# Altium schematic sheet Schematic.SchDoc
size B; SheetNumber: 1; SheetTotal: 1
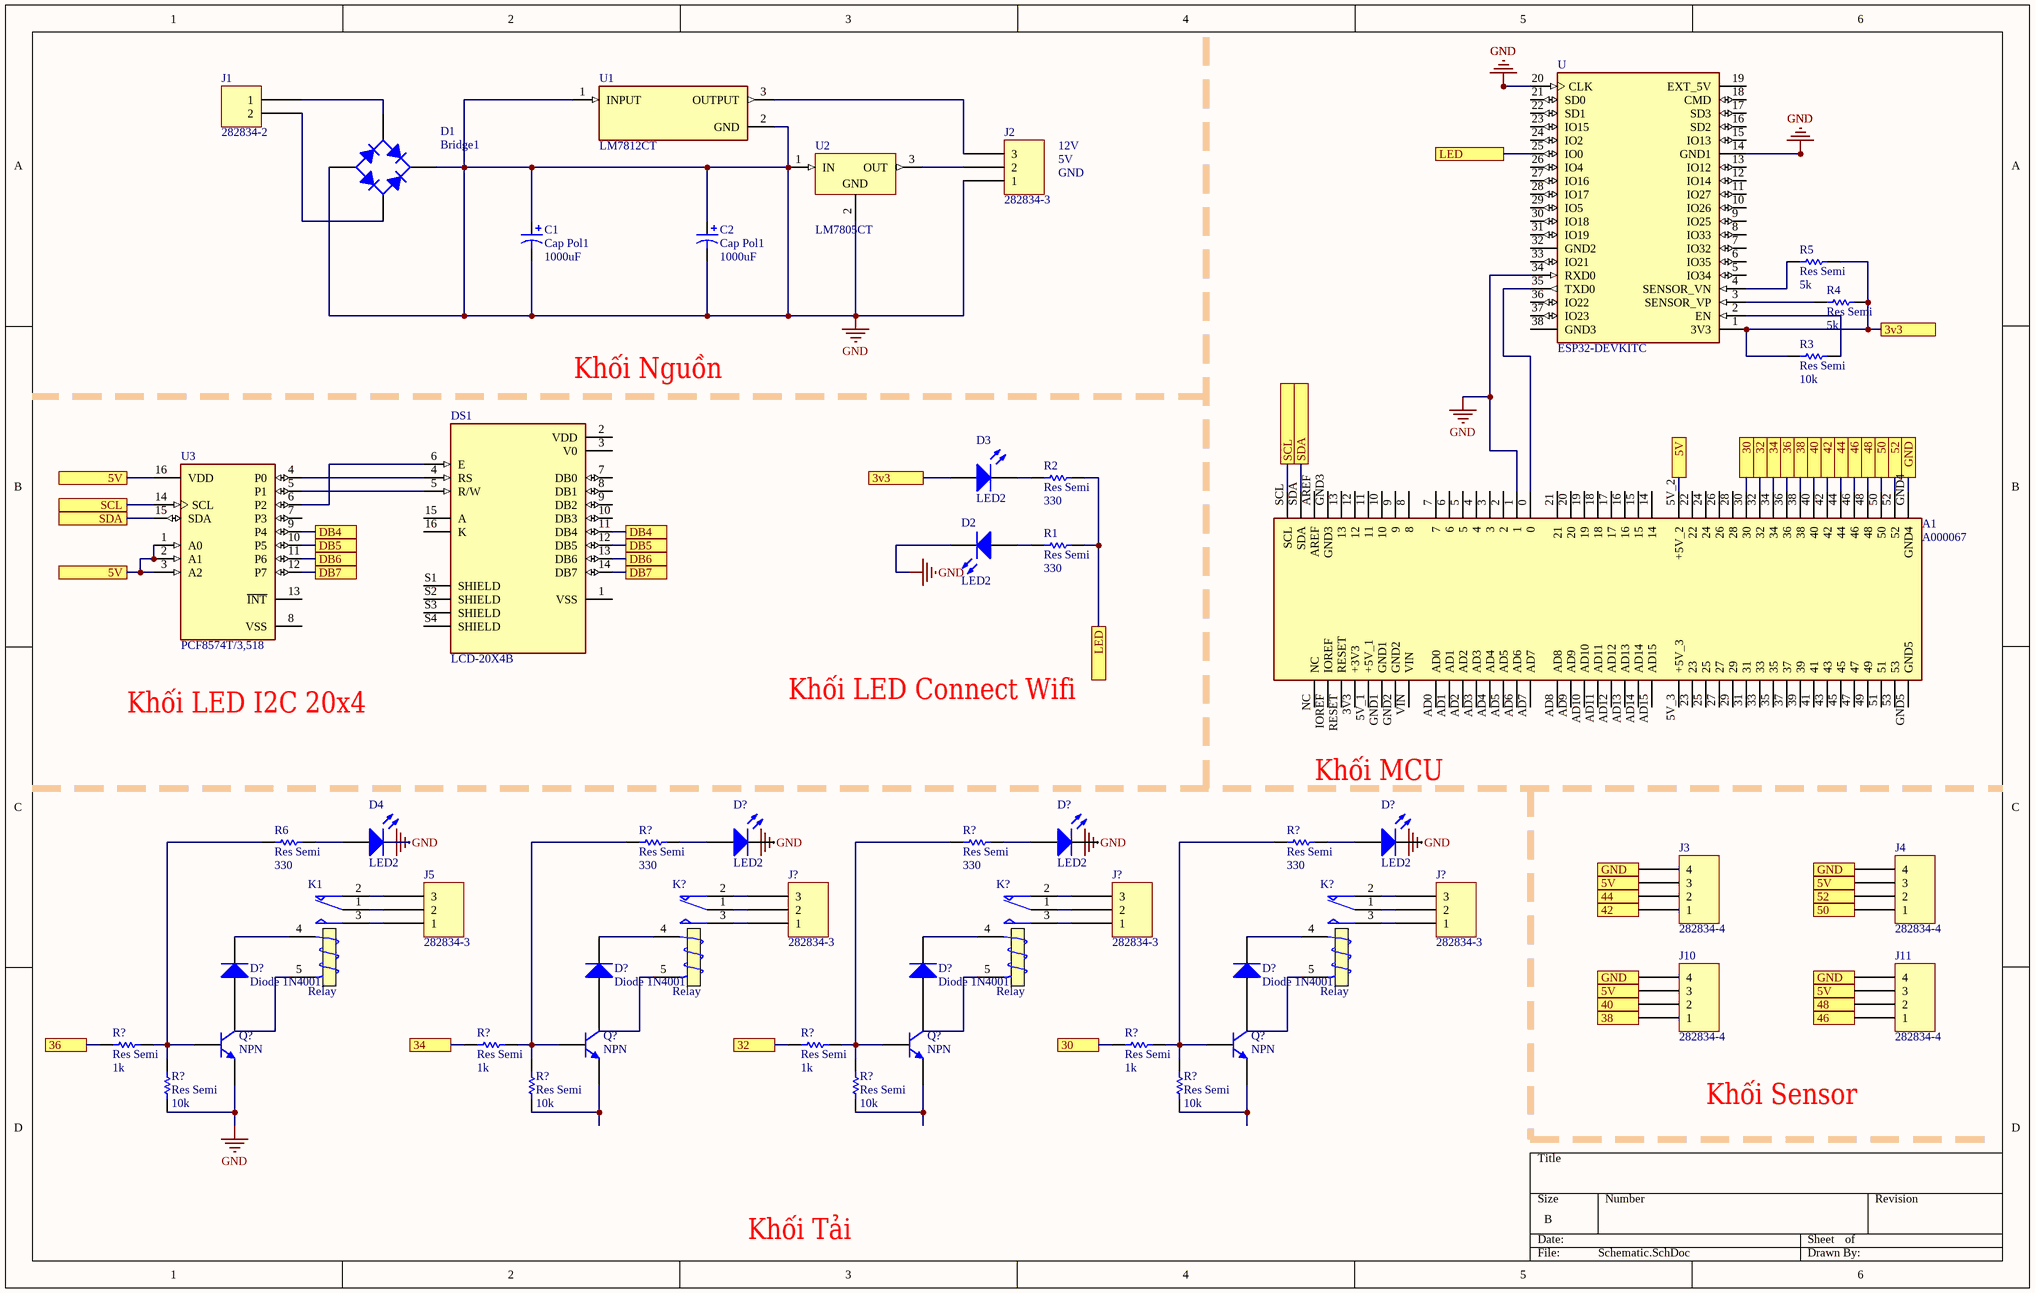
[diagram p0: Schematic.SchDoc]

## Parts
(Parts that share a designator on the sheet are numbered #1, #2 ... from top to bottom, then left to right.)
A1  A000067  [ARDUINO_A000067]
C1  Cap Pol1  value 1000uF  [RB7.6-15]
C2  Cap Pol1  value 1000uF  [RB7.6-15]
D1  Bridge1  [D-38]
D2  LED2  [3.2X1.6X1.1]
D3  LED2  [3.2X1.6X1.1]
D4  LED2  [3.2X1.6X1.1]
D?#1  LED2  [3.2X1.6X1.1]
D?#2  LED2  [3.2X1.6X1.1]
D?#3  LED2  [3.2X1.6X1.1]
D?#4  Diode 1N4001  [DO-41]
D?#5  Diode 1N4001  [DO-41]
D?#6  Diode 1N4001  [DO-41]
D?#7  Diode 1N4001  [DO-41]
DS1  LCD-20X4B  [LCD_LCD-20X4B]
J1  282834-2  [TE 282834-2]
J2  282834-3  [TE 282834-3]
J3  282834-4  [TE 282834-4]
J4  282834-4  [TE 282834-4]
J5  282834-3  [TE 282834-3]
J10  282834-4  [TE 282834-4]
J11  282834-4  [TE 282834-4]
J?#1  282834-3  [TE 282834-3]
J?#2  282834-3  [TE 282834-3]
J?#3  282834-3  [TE 282834-3]
K1  Relay  [MODULE5B]
K?#1  Relay  [MODULE5B]
K?#2  Relay  [MODULE5B]
K?#3  Relay  [MODULE5B]
Q?#1  NPN  [TO-226-AA]
Q?#2  NPN  [TO-226-AA]
Q?#3  NPN  [TO-226-AA]
Q?#4  NPN  [TO-226-AA]
R1  Res Semi  value 330  [AXIAL-0.5]
R2  Res Semi  value 330  [AXIAL-0.5]
R3  Res Semi  value 10k  [AXIAL-0.5]
R4  Res Semi  value 5k  [AXIAL-0.5]
R5  Res Semi  value 5k  [AXIAL-0.5]
R6  Res Semi  value 330  [AXIAL-0.5]
R?#1  Res Semi  value 330  [AXIAL-0.5]
R?#2  Res Semi  value 330  [AXIAL-0.5]
R?#3  Res Semi  value 330  [AXIAL-0.5]
R?#4  Res Semi  value 1k  [AXIAL-0.5]
R?#5  Res Semi  value 1k  [AXIAL-0.5]
R?#6  Res Semi  value 1k  [AXIAL-0.5]
R?#7  Res Semi  value 1k  [AXIAL-0.5]
R?#8  Res Semi  value 10k  [AXIAL-0.5]
R?#9  Res Semi  value 10k  [AXIAL-0.5]
R?#10  Res Semi  value 10k  [AXIAL-0.5]
R?#11  Res Semi  value 10k  [AXIAL-0.5]
U  ESP32-DEVKITC  [MODULE_ESP32-DEVKITC]
U1  LM7812CT  [FP-TO220B03-MFG]
U2  LM7805CT  [FAIR-TO-220-3]
U3  PCF8574T/3,518  [FP-SOT162-1-MFG]

## Ports
3v3, 5V, 30, 32, 34, 36, 38, 40, 42, 44, 46, 48, 50, 52, DB4, DB5, DB6, DB7, GND, LED, SCL, SDA

## Nets
GND: A1.1 C1.1 C1.2 C2.1 C2.2 D1.1(K) D1.3(A) D2.2(K) D4.2(K) D?#1.2(K) D?#2.2(K) D?#3.2(K) J2.1 Q?#1.3(E) R?#8.1 U.14(GND1) U.20(CLK) U.34(RXD0) U1.1(INPUT) U1.2(GND) U2.1(IN) U2.2(GND)
3v3: D3.1(A) R3.1 R4.2 R5.2 U.1(3V3) ; port 3v3
5V: A1.5V_2(+5V_2) J3.3 J4.3 J10.3 J11.3 U3.1(A0) U3.2(A1) U3.3(A2) U3.16(VDD) ; port 5V
30: A1.30 R?#7.1 ; port 30
32: A1.32 R?#6.1 ; port 32
34: A1.34 R?#5.1 ; port 34
36: A1.36 R?#4.1 ; port 36
38: A1.38 J10.1 ; port 38
40: A1.40 J10.2 ; port 40
42: A1.42 J3.1 ; port 42
44: A1.44 J3.2 ; port 44
46: A1.46 J11.1 ; port 46
48: A1.48 J11.2 ; port 48
50: A1.50 J4.1 ; port 50
52: A1.52 J4.2 ; port 52
DB4: DS1.11(DB4) U3.9(P4) ; port DB4
DB5: DS1.12(DB5) U3.10(P5) ; port DB5
DB6: DS1.13(DB6) U3.11(P6) ; port DB6
DB7: DS1.14(DB7) U3.12(P7) ; port DB7
GND: A1.GND4 J3.4 J4.4 J10.4 J11.4 ; port GND  [a separate net that carries the same name]
LED: R1.1 R2.1 U.25(IO0) ; port LED
SCL: A1.SCL U3.14(SCL) ; port SCL
SDA: A1.SDA U3.15(SDA) ; port SDA
NetA1_0: A1.0 U.35(TXD0)
NetD1_2: D1.2(C) J1.2
NetD1_4: D1.4(C) J1.1
NetD2_1: D2.1(A) R1.2
NetD3_2: D3.2(K) R2.2
NetD4_1: D4.1(A) R6.2
NetD?#1_1: D?#1.1(A) R?#1.2
NetD?#2_1: D?#2.1(A) R?#2.2
NetD?#3_1: D?#3.1(A) R?#3.2
NetD?#4_1: D?#4.1(A) Q?#1.1(C)
NetD?#4_2: D?#4.2(K) K1.4(T1)
NetD?#5_1: D?#5.1(A) Q?#2.1(C)
NetD?#5_2: D?#5.2(K) K?#1.4(T1)
NetD?#6_1: D?#6.1(A) Q?#3.1(C)
NetD?#6_2: D?#6.2(K) K?#2.4(T1)
NetD?#7_1: D?#7.1(A) Q?#4.1(C)
NetD?#7_2: D?#7.2(K) K?#3.4(T1)
NetDS1_4: DS1.4(RS) U3.4(P0)
NetDS1_5: DS1.5(R/W) U3.5(P1)
NetDS1_6: DS1.6(E) U3.6(P2)
NetJ2_2: J2.2 U2.3(OUT)
NetJ2_3: J2.3 U1.3(OUTPUT)
NetJ5_1: J5.1 K1.3(NO)
NetJ5_2: J5.2 K1.1(COM)
NetJ5_3: J5.3 K1.2(NC)
NetJ?#1_1: J?#1.1 K?#1.3(NO)
NetJ?#1_2: J?#1.2 K?#1.1(COM)
NetJ?#1_3: J?#1.3 K?#1.2(NC)
NetJ?#2_1: J?#2.1 K?#2.3(NO)
NetJ?#2_2: J?#2.2 K?#2.1(COM)
NetJ?#2_3: J?#2.3 K?#2.2(NC)
NetJ?#3_1: J?#3.1 K?#3.3(NO)
NetJ?#3_2: J?#3.2 K?#3.1(COM)
NetJ?#3_3: J?#3.3 K?#3.2(NC)
NetQ?#1_2: Q?#1.2(B) R6.1 R?#4.2 R?#8.2
NetQ?#2_2: Q?#2.2(B) R?#1.1 R?#5.2 R?#9.2
NetQ?#2_3: Q?#2.3(E) R?#9.1
NetQ?#3_2: Q?#3.2(B) R?#2.1 R?#6.2 R?#10.2
NetQ?#3_3: Q?#3.3(E) R?#10.1
NetQ?#4_2: Q?#4.2(B) R?#3.1 R?#7.2 R?#11.2
NetQ?#4_3: Q?#4.3(E) R?#11.1
NetR3_2: R3.2 U.2(EN)
NetR4_1: R4.1 U.3(SENSOR_VP)
NetR5_1: R5.1 U.4(SENSOR_VN)

Not connected (* = marked no-connect by the designer): A1 2 3 3V3(+3V3) 4 5 5V_1(+5V_1) 5V_3(+5V_3) 6 7 8 9 10 11 12 13 14 15 16 17 18 19 20 21 22 23 24 25 26 27 28 29 31 33 35 37 39 41 43 45 47 49 51 53 AD0 AD1 AD2 AD3 AD4 AD5 AD6 AD7 AD8 AD9 AD10 AD11 AD12 AD13 AD14 AD15 AREF GND1 GND2 GND3 GND5 IOREF NC RESET VIN; DS1 1(VSS) 2(VDD) 3(V0) 7(DB0) 8(DB1) 9(DB2) 10(DB3) 15(A) 16(K) S1(SHIELD) S2(SHIELD) S3(SHIELD) S4(SHIELD); K1 5(T2); K?#1 5(T2); K?#2 5(T2); K?#3 5(T2); U 5(IO34) 6(IO35) 7(IO32) 8(IO33) 9(IO25) 10(IO26) 11(IO27) 12(IO14) 13(IO12) 15(IO13) 16(SD2) 17(SD3) 18(CMD) 19(EXT_5V) 21(SD0) 22(SD1) 23(IO15) 24(IO2) 26(IO4) 27(IO16) 28(IO17) 29(IO5) 30(IO18) 31(IO19) 32(GND2) 33(IO21) 36(IO22) 37(IO23) 38(GND3); U3 7(P3) 8(VSS) 13(~{INT})

## Notes on the sheet
- 12V
- 5V
- GND
- (near DS1) Khối Nguồn
- Khối LED Connect Wifi
- Khối LED I2C 20x4
- Khối MCU
- Khối Sensor
- Khối Tải

## Library data of the parts
A1 = A000067: Arduino Mega 2560 Rev3. ATmega2560 Microcontroller Mega Development Board 16MHz CPU 8KB RAM 4KB/256KB EEPROM/Flash; MF: Arduino; Package: Non-Standard Arduino; Price: None; Check_prices: https://www.snapeda.com/parts/A000067/Arduino/view-part/?ref=eda; Value: *; SnapEDA_Link: https://www.snapeda.com/parts/A000067/Arduino/view-part/?ref=snap; MP: A000067; Availability: In Stock; Purchase-URL: https://pricing.snapeda.com/search?q=A000067&ref=eda
C1 C2 = Cap Pol1: Polarized Capacitor (Radial); Published: 8-Jun-2000; LatestRevisionDate: 17-Jul-2002; LatestRevisionNote: Re-released for DXP Platform.; PackageReference: RB7.6-15; Publisher: Altium Limited; PackageDescription: Polarized Capacitor (Radial); 2 Leads
D1 = Bridge1: Full Wave Diode Bridge; Published: 8-Jun-2000; LatestRevisionDate: 29-May-2009; LatestRevisionNote: Sch pins A & K swapped.; DatasheetVersion: E2732B; PackageReference: D-38; Publisher: Altium Limited; PackageDescription: Bridge Rectifier; 4 Terminals; Body 9.4 x 9.4 mm (typ); Pitch 5.08 mm
D2-D4 D?#1-D?#3 = LED2: Typical RED, GREEN, YELLOW, AMBER GaAs LED; Published: 8-Jun-2000; LatestRevisionDate: 17-Jul-2002; LatestRevisionNote: Re-released for DXP Platform.; PackageVersion: Feb-2002; PackageReference: 3.2X1.6X1.1; Publisher: Altium Limited; PackageDescription: SM LED; 2 Flat Leads
D?#4-D?#7 = Diode 1N4001: 1 Amp General Purpose Rectifier; Published: 8-Jun-2000; LatestRevisionDate: 17-Jul-2002; LatestRevisionNote: Re-released for DXP Platform.; DatasheetVersion: 1998; PackageVersion: Aug-1999; PackageReference: DO-41; Publisher: Altium Limited; PackageDescription: Diode, Axial; Body 5.2 x 2.7 mm (LxDia. max), Lead Dia. 0.86 mm (max); Code_JEDEC: DO-204-AL; ComponentLink1Description: Manufacturer Link; ComponentLink1URL: http://www.fairchildsemi.com/; ComponentLink2Description: Datasheet; ComponentLink2URL: http://www.fairchildsemi.com/ds/1N%2F1N4001.pdf
DS1 = LCD-20X4B: Display Development Tools 20X4 CHARACTER BLUE LCD W/BACKLIGHT; MF: Gravitech; MP: LCD-20X4B; Purchase-URL: https://pricing.snapeda.com/search/part/LCD-20X4B/?ref=eda; Value: *; SnapEDA_Link: https://www.snapeda.com/parts/LCD-20X4B/Gravitech/view-part/?ref=snap; Price: None; Package: None; Check_prices: https://www.snapeda.com/parts/LCD-20X4B/Gravitech/view-part/?ref=eda; Availability: In Stock
J1 = 282834-2: TERM BLK 2P SIDE ENT 2.54MM PCB; Manufacturer: TE Connectivity AMP Connectors; Current: 10A; Mating Orientation: Horizontal with Board; Number of Levels: 1; Pitch: 0.100" (2.54mm); Positions Per Level: 2; Voltage: 150V; Wire Gauge: 16-30 AWG; Wire Termination: Screw - Rising Cage Clamp; Part Number: 282834-2; Color: Green; ComponentLink1Description: Datasheet; ComponentLink1URL: https://www.te.com/commerce/DocumentDelivery/DDEController?Action=srchrtrv&DocNm=282834&DocType=Customer+Drawing&DocLang=English; ComponentLink2Description: DigiKey Link; ComponentLink2URL: http://digikey.com/product-detail/en/te-connectivity-amp-connectors/282834-2/A98333-ND/1150135; LastUpdated: 1/15/2020 4:15:38 AM; Lifecycle Status: Active; Minimum Order: 1; Mounting Type: Through Hole; Packaging: Bulk; Part Status: Active; Price: 0.88; Series: Buchanan; Supplier 1: DigiKey; Supplier Part Number 1: A98333-ND
J2 J5 J?#1-J?#3 = 282834-3: TERM BLK 3P SIDE ENT 2.54MM PCB; Manufacturer: TE Connectivity AMP Connectors; Current: 10A; Mating Orientation: Horizontal with Board; Number of Levels: 1; Pitch: 0.100" (2.54mm); Positions Per Level: 3; Voltage: 150V; Wire Gauge: 16-30 AWG; Wire Termination: Screw - Rising Cage Clamp; Part Number: 282834-3; Color: Green; ComponentLink1Description: Datasheet; ComponentLink1URL: https://www.te.com/commerce/DocumentDelivery/DDEController?Action=srchrtrv&DocNm=282834&DocType=Customer+Drawing&DocLang=English; ComponentLink2Description: DigiKey Link; ComponentLink2URL: http://digikey.com/product-detail/en/te-connectivity-amp-connectors/282834-3/A98334-ND/1153264; LastUpdated: 1/15/2020 4:15:50 AM; Lifecycle Status: Active; Minimum Order: 1; Mounting Type: Through Hole; Packaging: Bulk; Part Status: Active; Price: 2.01; Series: Buchanan; Supplier 1: DigiKey; Supplier Part Number 1: A98334-ND
J3 J4 J10 J11 = 282834-4: TERM BLK 4P SIDE ENT 2.54MM PCB; Manufacturer: TE Connectivity AMP Connectors; Current: 10A; Mating Orientation: Horizontal with Board; Number of Levels: 1; Pitch: 0.100" (2.54mm); Positions Per Level: 4; Voltage: 150V; Wire Gauge: 16-30 AWG; Wire Termination: Screw - Rising Cage Clamp; Part Number: 282834-4; Color: Green; ComponentLink1Description: Datasheet; ComponentLink1URL: https://www.te.com/commerce/DocumentDelivery/DDEController?Action=srchrtrv&DocNm=282834&DocType=Customer+Drawing&DocLang=English; ComponentLink2Description: DigiKey Link; ComponentLink2URL: http://digikey.com/product-detail/en/te-connectivity-amp-connectors/282834-4/A98335-ND/1153265; LastUpdated: 1/15/2020 4:16:05 AM; Lifecycle Status: Active; Minimum Order: 1; Mounting Type: Through Hole; Packaging: Bulk; Part Status: Active; Price: 2.68; Series: Buchanan; Supplier 1: DigiKey; Supplier Part Number 1: A98335-ND
K1 K?#1-K?#3 = Relay: SPDT Relay; Published: 8-Jun-2000; LatestRevisionDate: 17-Jul-2002; LatestRevisionNote: Re-released for DXP Platform.; PackageReference: MODULE5B; Publisher: Altium Limited
Q?#1-Q?#4 = NPN: NPN Bipolar Transistor; Published: 8-Jun-2000; LatestRevisionDate: 17-Jul-2002; LatestRevisionNote: Re-released for DXP Platform.; PackageReference: TO-226-AA; Publisher: Altium Limited; PackageDescription: TO, Flat Index; 3 In-Line, Axial Leads; Body Dia. 4.8mm; Leads 0.55 x 0.51 mm (max); Code_JEDEC: TO-226-AA
R1-R6 R?#1-R?#11 = Res Semi: Semiconductor Resistor; Published: 8-Jun-2000; LatestRevisionDate: 17-Jul-2002; LatestRevisionNote: Re-released for DXP Platform.; PackageReference: AXIAL-0.5; Publisher: Altium Limited; PackageDescription: Axial Device, Thru-Hole; 2 Leads; 0.5 in Pin Spacing
U = ESP32-DEVKITC: - Transceiver; 802.11 b/g/n _Wi-Fi, WiFi, WLAN_, BluetoothÂ® Smart Ready 4.x Dual Mode For Use With ESP-WROOM-32; MP: ESP32-DEVKITC-32D-F; MF: Espressif Systems; Price: None; SnapEDA_Link: https://www.snapeda.com/parts/ESP32-DEVKITC-32D-F/Espressif%20Systems/view-part/4220172/?ref=snap; Availability: Unavailable; Value: *; Package: None
U1 = CMP-07128-000015-1: IC REG LINEAR 12V 1A TO220-3; Obsolete Part: true; Manufacturer: ON Semiconductor; Nominal Supply Current: 5.1mA; Output Type: Fixed; Dropout Voltage: 2V; Max Supply Voltage: 35V; Accuracy Percentage: 4%; Standoff Height: 2.7mm; Number Of Outputs: 1; Octopart: https://octopart.com/lm7812ct-on+semiconductor-14383031; Output Current: 1A; ComponentLink2Description: Datasheet; Device Class L1: Integrated Circuits (ICs); Device Class L2: Power Management ICs; Temperature Range Low: -40°C; Category: IC; Package: TO220B03; Device Class L3: Voltage Regulators - Linear; RoHS: TRUE; Digikey Description: IC REG LINEAR 12V 1A TO220-3; Ipc Land Pattern Name: TO-220; Output Voltage: 12V; Temperature: -40°C to +125°C; Automotive: No; Temperature Range High: +125°C; ComponentLink2URL: https://www.mouser.in/datasheet/2/308/LM7812-1125088.pdf; Manufacturer Part Number: LM7812CT; Height: 20.4mm; Lead Free: Yes
U2 = CMP-2000-04938-1: Positive Voltage Regulator, 5 V, 1 A, -40 to 125 degC, 3-Pin TO-220, RoHS, Tube; Manufacturer: FairchildSemiconductor; Maximum Input Voltage: 35V; Maximum Quiescent Current: 8mA; Load Regulation: 100mV; Maximum Output Current: 2.2(Typ)A; Output Type: Fixed; Typical Dropout Voltage @ Current: 2@1AV; Rad Hard: No; Output Voltage: 5V; Accuracy: ±4%; Number of Outputs: 1; Category: LinearRegulator; Package Description: 3-Pin Through Hole Device, Body 10 x 4.5 mm, Pitch 2.54 mm; Packaging: Rail/Tube; Mounting: ThroughHole; Polarity: Positive; Manufacturer URL: https://www.fairchildsemi.com/; Line Regulation: 100mV; Datasheet Version: Aug-12; Datasheet URL: https://datasheet.ciiva.com/26904/lm7805ct-26904988.pdf; Package Reference: TO-220; Package URL: https://www.fairchildsemi.com/package-drawings/TO/TO220B03.pdf; Package: 3TO-220AB; Operating Temperature: -40to125degC; Type: Linear
U3 = CMP-10112-000010-1: IC I/O EXPANDER I2C 8B 16SOIC; Manufacturer: NXP Semiconductors; Frequency: 100kHz; Max Supply Voltage: 6V; Standoff Height: 0.1mm; Nominal Supply Current: 40uA; Max Junction Temp: +125°C; Min Supply Voltage: 2.5V; Number Of I/Os: 8; Manufacturer Part Number: PCF8574T/3,518; Footprint Url: https://www.nxp.com/docs/en/package-information/SOT162-1.pdf; ComponentLink2URL: https://www.nxp.com/docs/en/data-sheet/PCF8574_PCF8574A.pdf; Automotive: No; Digikey Description: IC I/O EXPANDER I2C 8B 16SOIC; Mouser Description: PCF8574 Series 2.5 - 6V Remote 8-bit I/O Expander for I2C-bus - SOIC-16; Ipc Land Pattern Name: SOIC127P1032X265-16; Interface: I2C; Octopart: https://octopart.com/pcf8574t%2F3%2C518-nxp+semiconductors-10470852; Ambient Temperature Range Low: -40°C; Lead Free: Yes; Device Class L2: Interface ICs; Temperature Range High: +85°C; Device Class L1: Integrated Circuits (ICs); Package: SOT162-1; ComponentLink2Description: Datasheet; Device Class L3: I/O Expanders; Temperature: -40°C to +85°C; Ambient Temperature Range High: +85°C; Height: 2.65mm; Category: IC; RoHS: TRUE; Temperature Range Low: -40°C